# Altium project Power Distribution Board.PrjPcb (part 2 of 2)

## Sheet SH8 - CAN.SchDoc: CAN
size B; Engineer: Farris Matar; Organization: UW Robotics; Address1: 200 University Avenue; Address2: Waterloo; Address3: Ontario; Address4: Canada N2L 3G6; DocumentNumber: 8; Revision: 3; SheetNumber: 8; SheetTotal: 9
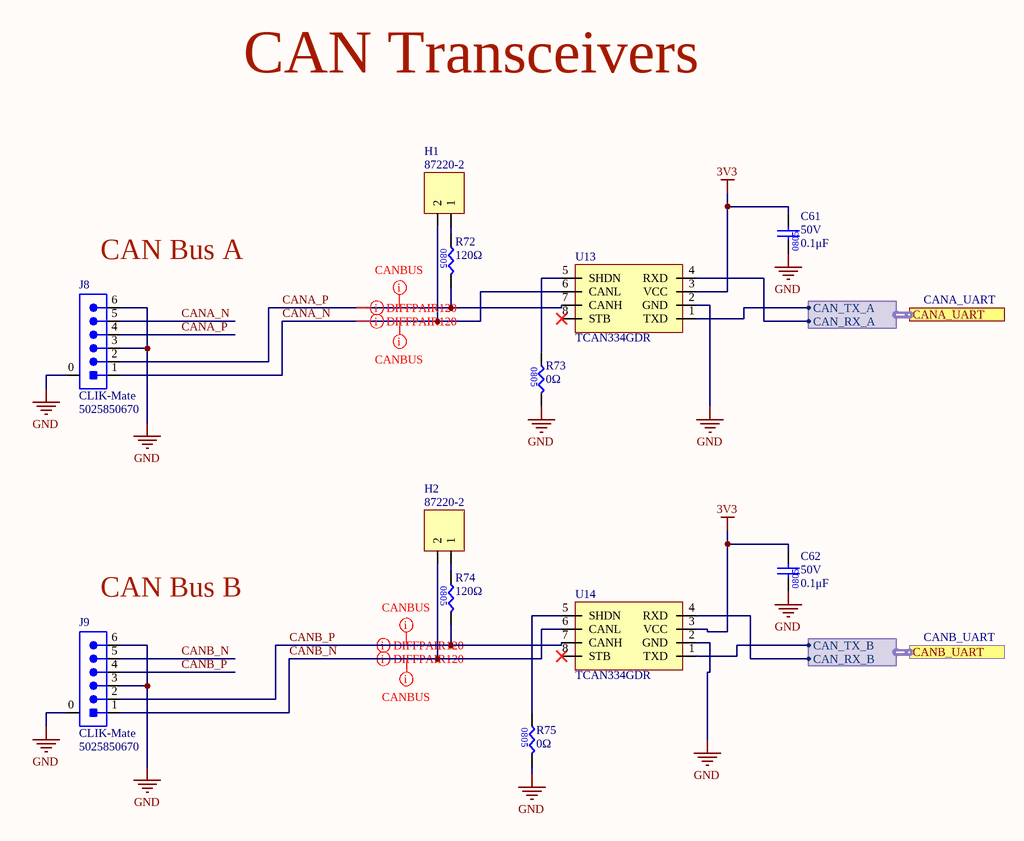
[diagram p7: SH8 - CAN.SchDoc]

### Parts
C61  value 0.1μF  Voltage Rating: 50V  [CAP2012]  (hidden comment: CAP_0.1uF_50V_0805)
C62  value 0.1μF  Voltage Rating: 50V  [CAP2012]  (hidden comment: CAP_0.1uF_50V_0805)
H1  Manufacturer Part Number 1: 87220-2  [HDR1X2]  (hidden comment: JUMPER_2)
H2  Manufacturer Part Number 1: 87220-2  [HDR1X2]  (hidden comment: JUMPER_2)
J8  Family: CLIK-Mate  Manufacturer Part Number 1: 5025850670  [MOLEX-5025850670]  (hidden comment: CON_6M_SM_RA_1.5mm)
J9  Family: CLIK-Mate  Manufacturer Part Number 1: 5025850670  [MOLEX-5025850670]  (hidden comment: CON_6M_SM_RA_1.5mm)
R72  value 120Ω  [RES0805]  (hidden comment: RES_120Ω_0805_1%)
R73  value 0Ω  [RES0805]  (hidden comment: RES_0Ω_0805)
R74  value 120Ω  [RES0805]  (hidden comment: RES_120Ω_0805_1%)
R75  value 0Ω  [RES0805]  (hidden comment: RES_0Ω_0805)
U13  Manufacturer Part Number 1: TCAN334GDR  [SOIC127P600X175-8N]  (hidden comment: IC_CAN_TRANSCEIVER)
U14  Manufacturer Part Number 1: TCAN334GDR  [SOIC127P600X175-8N]  (hidden comment: IC_CAN_TRANSCEIVER)

### Ports
CANA_UART (harness CANA_UART), CANB_UART (harness CANB_UART)

### Harnesses
CANA_UART: CAN_RX_A, CAN_TX_A
CANB_UART: CAN_RX_B, CAN_TX_B

### Nets
3V3: C61.2 C62.2 U13.3(VCC) U14.3(VCC)
GND: C61.1 C62.1 J8.0 J8.3 J8.6 J9.0 J9.3 J9.6 R73.2 R75.2 U13.2(GND) U14.2(GND)
CANA_N: H1.2 J8.1 J8.5 U13.6(CANL)
CANA_P: J8.2 J8.4 R72.2 U13.7(CANH)
CANB_N: H2.2 J9.1 J9.5 U14.6(CANL)
CANB_P: J9.2 J9.4 R74.2 U14.7(CANH)
NetH1_1: H1.1 R72.1
NetH2_1: H2.1 R74.1
NetR73_1: R73.1 U13.5(SHDN)
NetR75_1: R75.1 U14.5(SHDN)
NetU11_33: U14.4(RXD) ; port CANB_UART.CAN_RX_B
NetU11_34: U14.1(TXD) ; port CANB_UART.CAN_TX_B
NetU11_44: U13.4(RXD) ; port CANA_UART.CAN_RX_A
NetU11_45: U13.1(TXD) ; port CANA_UART.CAN_TX_A

Not connected (* = marked no-connect by the designer): U13 8(STB)*; U14 8(STB)*

### Layout directives
differential pair; differential pair class CANBUS120: CANA_N, CANA_P, CANB_N, CANB_P
mark named CANBUS: CANA_N, CANA_P, CANB_N, CANB_P

### Notes on the sheet
- CAN Transceivers
- (near J8) CAN Bus A
- (near J9) CAN Bus B
- Title:
- Project:
- Date:
- Rev:
- Reviewer:
- Engineer:
- Sheet:
- of

### Library data of the parts
C61 C62 = CAP_0.1uF_50V_0805: CAP CER 0.1UF 50V X7R 0805; Manufacturer Part Number 1: GCM21BR71H104KA37K; Manufacturer 1: Murata Electronics; Package/Footprint: 0805; Supplier Part Number 1: 490-8049-1-ND; Supplier 1: Digi-Key; Dielectric: X7R; LCSC Part #: C49678; Mounting Type: SMD
H1 H2 = JUMPER_2: HEADER 2X1; Manufacturer 1: TE Connectivity; Package/Footprint: TH; Supplier 1: Digi-Key; Supplier Part Number 1: A26542-ND; Mount: Through Hole; Mounting Type: TH
J8 J9 = CON_6M_SM_RA_1.5mm: CONN HEADER SMD RIGHT ANGLE 1.5 MM PITCH; Manufacturer 1: Molex; Supplier 1: Digi-Key; Supplier Part Number 1: WM12832CT-ND; Package/Footprint: SMD; Mounting Type: SMD
R72 R74 = RES_120Ω_0805_1%: RES 120 OHM 1% 1/8W 0805; Manufacturer 1: Vishay; Manufacturer Part Number 1: CRCW0805120RFKEA; Package/Footprint: 0805; Supplier Part Number 1: 541-120CCT-ND; Supplier 1: Digi-Key; LCSC Part #: C17437; Mounting Type: SMD
R73 R75 = RES_0Ω_0805: RES 0 OHM JUMPER 1/8W 0805; Manufacturer 1: Panasonic Electronic Components; Manufacturer Part Number 1: ERJ-6GEY0R00V; Package/Footprint: 0805; Supplier Part Number 1: P0.0ACT-ND; Supplier 1: Digi-Key; LCSC Part #: C17477; Mounting Type: SMD
U13 U14 = IC_CAN_TRANSCEIVER: IC TRANSCEIVER 1/1 8SOIC; Manufacturer 1: Maxim; Package/Footprint: 14-SOIC; Mounting Type: SMD; Supplier 1: Digi-Key; Supplier Part Number 1: 296-49940-1-ND

## Sheet SH9 - RS-485.SchDoc: RS-485
size B; CheckedBy: Cindy Li; DrawnBy: Farris Matar; Engineer: Farris Matar; Organization: UW Robotics; Address1: 200 University Avenue; Address2: Waterloo; Address3: Ontario; Address4: Canada N2L 3G6; DocumentNumber: 9; Revision: 3; SheetNumber: 9; SheetTotal: 9
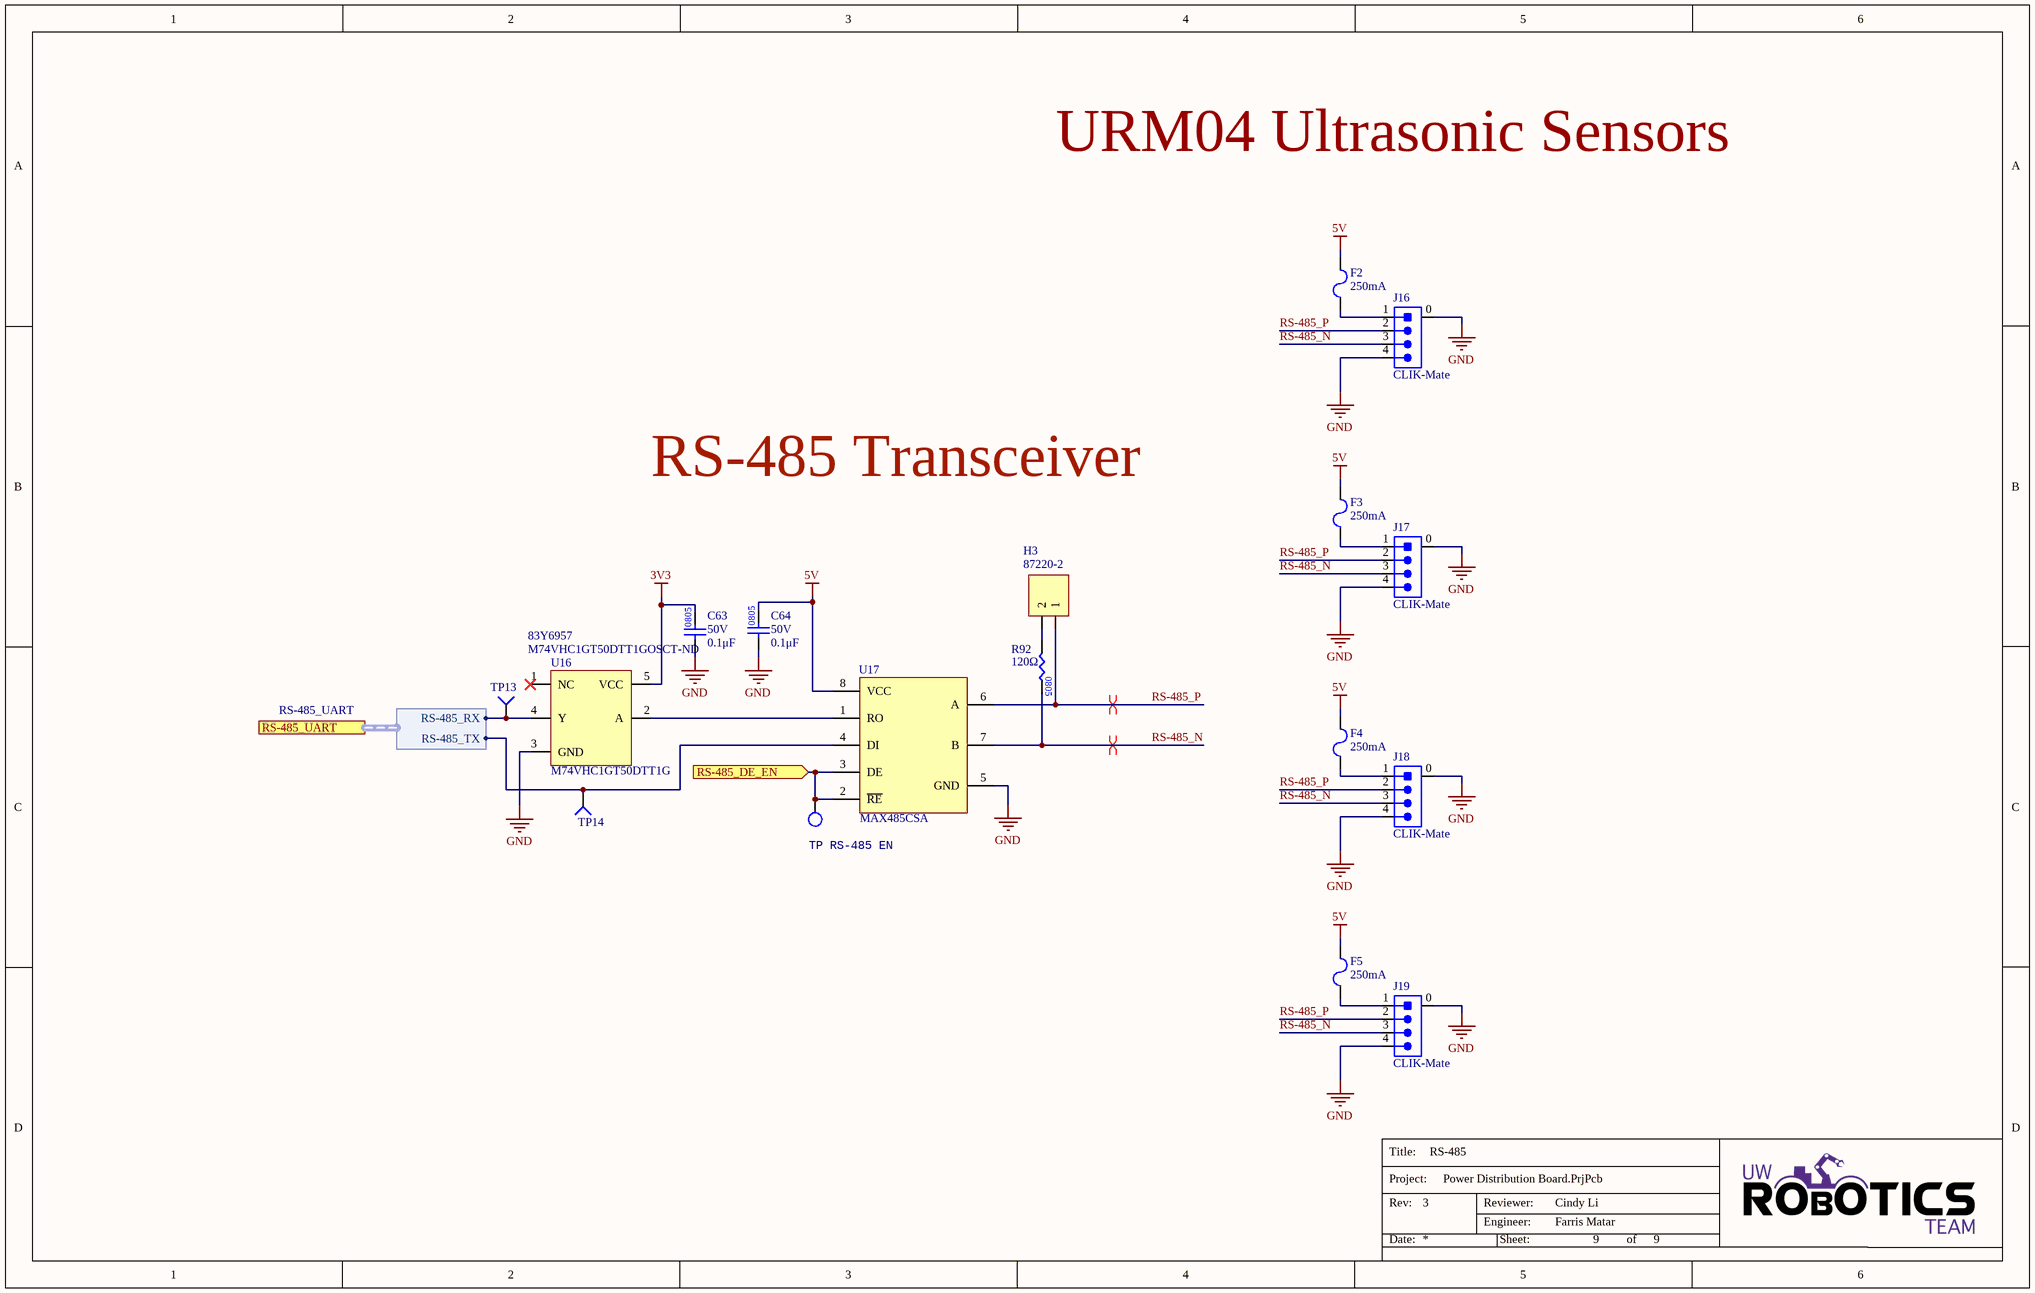
[diagram p8: SH9 - RS-485.SchDoc]

### Parts
C63  value 0.1μF  Voltage Rating: 50V  [CAP2012]  (hidden comment: CAP_0.1uF_50V_0805)
C64  value 0.1μF  Voltage Rating: 50V  [CAP2012]  (hidden comment: CAP_0.1uF_50V_0805)
F2  Current Rating: 250mA  [FUSE_1206]  (hidden comment: FUSE_250mA_1206)
F3  Current Rating: 250mA  [FUSE_1206]  (hidden comment: FUSE_250mA_1206)
F4  Current Rating: 250mA  [FUSE_1206]  (hidden comment: FUSE_250mA_1206)
F5  Current Rating: 250mA  [FUSE_1206]  (hidden comment: FUSE_250mA_1206)
H3  Manufacturer Part Number 1: 87220-2  [HDR1X2]  (hidden comment: JUMPER_2)
J16  Family: CLIK-Mate  [MOLEX-5025850470]  (hidden comment: CON_4M_SM_RA)
J17  Family: CLIK-Mate  [MOLEX-5025850470]  (hidden comment: CON_4M_SM_RA)
J18  Family: CLIK-Mate  [MOLEX-5025850470]  (hidden comment: CON_4M_SM_RA)
J19  Family: CLIK-Mate  [MOLEX-5025850470]  (hidden comment: CON_4M_SM_RA)
R92  value 120Ω  [RES0805]  (hidden comment: RES_120Ω_0805_1%)
TP13  TESTPOINT_1MM_CIRCLE  [TESTPOINT_CIRCLE_1MM]  (value not drawn)  (no BOM)
TP14  TESTPOINT_1MM_CIRCLE  [TESTPOINT_CIRCLE_1MM]  (value not drawn)  (no BOM)
TP_RS-485_EN  TESTPOINT_LOOP  [TESTPOINT_LOOP]  (value not drawn)
U16  Manufacturer Part Number 1: M74VHC1GT50DTT1G  Supplier Part Number 1: M74VHC1GT50DTT1GOSCT-ND  Supplier Part Number 2: 83Y6957  [SOT23-5]  (hidden comment: IC_BUFFER)
U17  MAX485CSA  [SOIC127P600X175-8N]

### Ports
RS-485_DE_EN (in), RS-485_UART (harness RS-485_UART)

### Harnesses
RS-485_UART: RS-485_RX, RS-485_TX

### Nets
3V3: C63.2 U16.5(VCC)
5V: C64.2 F2.2 F3.2 F4.2 F5.2 U17.8(VCC)
GND: C63.1 C64.1 J16.0 J16.4 J17.0 J17.4 J18.0 J18.4 J19.0 J19.4 U16.3(GND) U17.5(GND)
RS-485_N: J16.3 J17.3 J18.3 J19.3 R92.2 U17.7(B)
RS-485_P: H3.1 J16.2 J17.2 J18.2 J19.2 U17.6(A)
NetF2_1: F2.1 J16.1
NetF3_1: F3.1 J17.1
NetF4_1: F4.1 J18.1
NetF5_1: F5.1 J19.1
NetH3_2: H3.2 R92.1
NetTP13_1: TP13.1(=value) U16.4(Y) ; port RS-485_UART.RS-485_RX
NetTP14_1: TP14.1(=value) U17.4(DI) ; port RS-485_UART.RS-485_TX
NetTP_RS-485_EN_1: TP_RS-485_EN.1 U17.2(~{RE}) U17.3(DE) ; port RS-485_DE_EN
NetU16_2: U16.2(A) U17.1(RO)

Not connected (* = marked no-connect by the designer): U16 1(NC)*

### Layout directives
differential pair: RS-485_N, RS-485_P

### Notes on the sheet
- URM04 Ultrasonic Sensors
- RS-485 Transceiver
- Title:
- Project:
- Date:
- Rev:
- Reviewer:
- Engineer:
- Sheet:
- of

### Library data of the parts
C63 C64 = CAP_0.1uF_50V_0805: as C61 on sheet SH8 - CAN; Supplier Part Number 1: 490-8049-1-ND; Supplier 1: Digi-Key; Dielectric: X7R; LCSC Part #: C49678; Mounting Type: SMD
F2-F5 = FUSE_250mA_1206: FUSE BOARD MNT 250MA 125VAC/VDC; Manufacturer 1: Littelfuse; Manufacturer Part Number 1: 0466.250NR; Package/Footprint: 1206; Supplier 1: Digi-Key; Supplier Part Number 1: F1452CT-ND; Mounting Type: SMD
H3 = JUMPER_2: as H1 on sheet SH8 - CAN; Supplier 1: Digi-Key; Supplier Part Number 1: A26542-ND; Mount: Through Hole; Mounting Type: TH
J16-J19 = CON_4M_SM_RA: CONN HEADER SMD RIGHT ANGLE 1.5 MM PITCH; Supplier 1: Digi-Key; Supplier Part Number 1: WM9449CT-ND; Package/Footprint: SMD; Mounting Type: SMD
R92 = RES_120Ω_0805_1%: as R72 on sheet SH8 - CAN; Supplier Part Number 1: 541-120CCT-ND; Supplier 1: Digi-Key; LCSC Part #: C17437; Mounting Type: SMD
TP13 TP14 = TESTPOINT_1MM_CIRCLE: TESTPOINT 1MM CIRCLE
TP_RS-485_EN = TESTPOINT_LOOP: TESTPOINT THRUHOLE; Manufacturer 1: Keystone Electronics; Manufacturer Part Number 1: 5002; Package/Footprint: TH; Supplier Part Number 1: 36-5002-ND; Supplier 1: Digi-Key; Mounting Type: TH
U16 = IC_BUFFER: IC BUFFER NON-INVERT 5.5V 5TSOP; Manufacturer 1: onsemi; Package/Footprint: TSOP-5; Mounting Type: SMD; Supplier 1: Digi-Key; Supplier 2: Newark
U17 = MAX485CSA: IC RS485 TRANSCEIVER HALF 1/1 8SOIC; Manufacturer 1: Maxim Integrated; Manufacturer Part Number 1: MAX485CSA+T; Protocol: RS422, RS485; Data Rate: 2.5Mbps; Supply Voltage: 4.75V - 5.25V; Package/Footprint: 8-SOIC; Supplier 1: Digi-Key; Supplier Part Number 1: MAX485CSA+TCT-ND; Mounting Type: SMD; LCSC Part #: C9945

## Nets that join several sheets
3V3: SH4 - 3.3V LINEAR REGULATOR (5 pins), SH5 - LOAD MONITORING 1 (8 pins), SH7 - MICROCONTROLLER (20 pins), SH8 - CAN (C61.2 C62.2 U13.3 U14.3), SH9 - RS-485 (C63.2 U16.5)
5V: SH3 - 5V BUCK CONVERTER (13 pins), SH4 - 3.3V LINEAR REGULATOR (C45.2 U5.1 U5.3), SH5 - LOAD MONITORING 1 (12 pins), SH6 - LOAD MONITORING 2 (R85.2), SH7 - MICROCONTROLLER (J5.1), SH9 - RS-485 (6 pins)
5V_LOAD1: SH5 - LOAD MONITORING 1 (C502.2 R501.1 U501.1 U501.2), SH6 - LOAD MONITORING 2 (J10.1)
5V_LOAD2: SH5 - LOAD MONITORING 1 (C504.2 R503.1 U502.1 U502.2), SH6 - LOAD MONITORING 2 (J11.1)
5V_LOAD3: SH5 - LOAD MONITORING 1 (C506.2 R505.1 U503.1 U503.2), SH6 - LOAD MONITORING 2 (J12.1)
5V_LOAD4: SH5 - LOAD MONITORING 1 (C508.2 R507.1 U504.1 U504.2), SH6 - LOAD MONITORING 2 (J14.1)
GND: SH1 - POWER (6 pins), SH2 - 17V BUCK CONVERTER (25 pins), SH3 - 5V BUCK CONVERTER (27 pins), SH4 - 3.3V LINEAR REGULATOR (5 pins), SH5 - LOAD MONITORING 1 (20 pins), SH6 - LOAD MONITORING 2 (14 pins), SH7 - MICROCONTROLLER (36 pins), SH8 - CAN (12 pins), SH9 - RS-485 (12 pins)
VBAT_FUSED: SH1 - POWER (F1.2 J2.1 J3.1 R93.2), SH2 - 17V BUCK CONVERTER (7 pins), SH3 - 5V BUCK CONVERTER (7 pins), SH6 - LOAD MONITORING 2 (J15.1 R87.2)
VCC 17V: SH2 - 17V BUCK CONVERTER (13 pins), SH6 - LOAD MONITORING 2 (R84.2 U15.3)
NetD16_1: SH6 - LOAD MONITORING 2 (D16.1 R85.1 R88.2), SH7 - MICROCONTROLLER (U11.20)
NetD17_1: SH6 - LOAD MONITORING 2 (D17.1 R84.1 R89.2), SH7 - MICROCONTROLLER (U11.21)
NetD19_1: SH6 - LOAD MONITORING 2 (D19.1 R87.1 R91.2), SH7 - MICROCONTROLLER (U11.27)
NetQ3_1: SH6 - LOAD MONITORING 2 (Q3.1 TP_17VEN.1), SH7 - MICROCONTROLLER (U11.24)
NetQ203_1: SH2 - 17V BUCK CONVERTER (Q203.1), SH7 - MICROCONTROLLER (U11.25)
NetTP13_1: SH7 - MICROCONTROLLER (U11.52), SH9 - RS-485 (TP13.1 U16.4)
NetTP14_1: SH7 - MICROCONTROLLER (U11.51), SH9 - RS-485 (TP14.1 U17.4)
NetTP_5VL1_1: SH5 - LOAD MONITORING 1 (TP_5VL1.1 U501.4), SH7 - MICROCONTROLLER (U11.22)
NetTP_5VL2_1: SH5 - LOAD MONITORING 1 (TP_5VL2.1 U502.4), SH7 - MICROCONTROLLER (U11.10)
NetTP_5VL3_1: SH5 - LOAD MONITORING 1 (TP_5VL3.1 U503.4), SH7 - MICROCONTROLLER (U11.8)
NetTP_5VL4_1: SH5 - LOAD MONITORING 1 (TP_5VL4.1 U504.4), SH7 - MICROCONTROLLER (U11.2)
NetTP_RS-485_EN_1: SH7 - MICROCONTROLLER (U11.37), SH9 - RS-485 (TP_RS-485_EN.1 U17.2 U17.3)
NetU11_33: SH7 - MICROCONTROLLER (U11.33), SH8 - CAN (U14.4)
NetU11_34: SH7 - MICROCONTROLLER (U11.34), SH8 - CAN (U14.1)
NetU11_44: SH7 - MICROCONTROLLER (U11.44), SH8 - CAN (U13.4)
NetU11_45: SH7 - MICROCONTROLLER (U11.45), SH8 - CAN (U13.1)

## Assembly variants
Only Populated Components: not fitted R28 R31 R44 R47 R60 R77